# EasyEDA Pro project NUEVO board Rev. B.epro, board PCB1_1
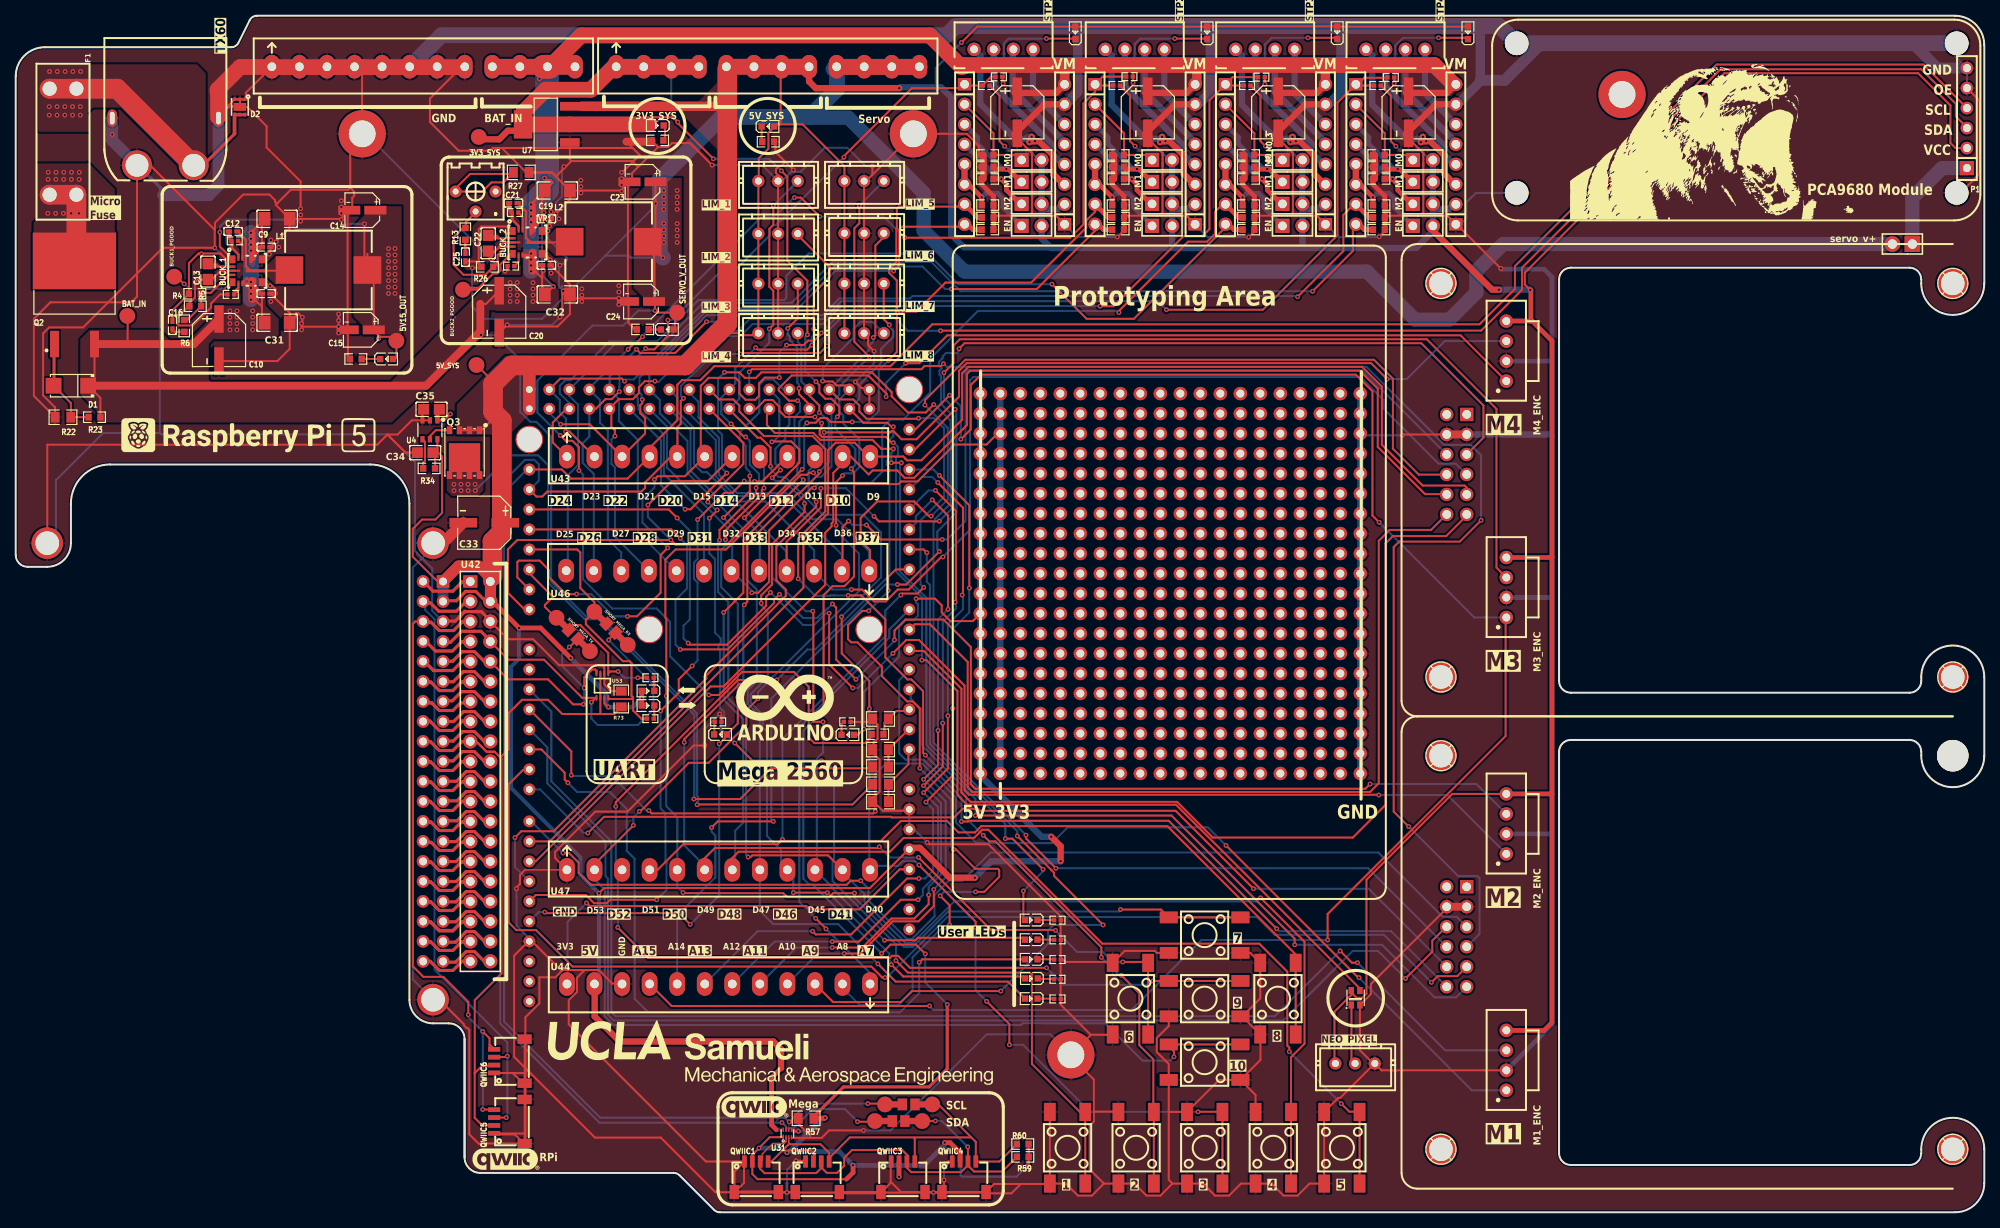
[diagram p12: board, top side]
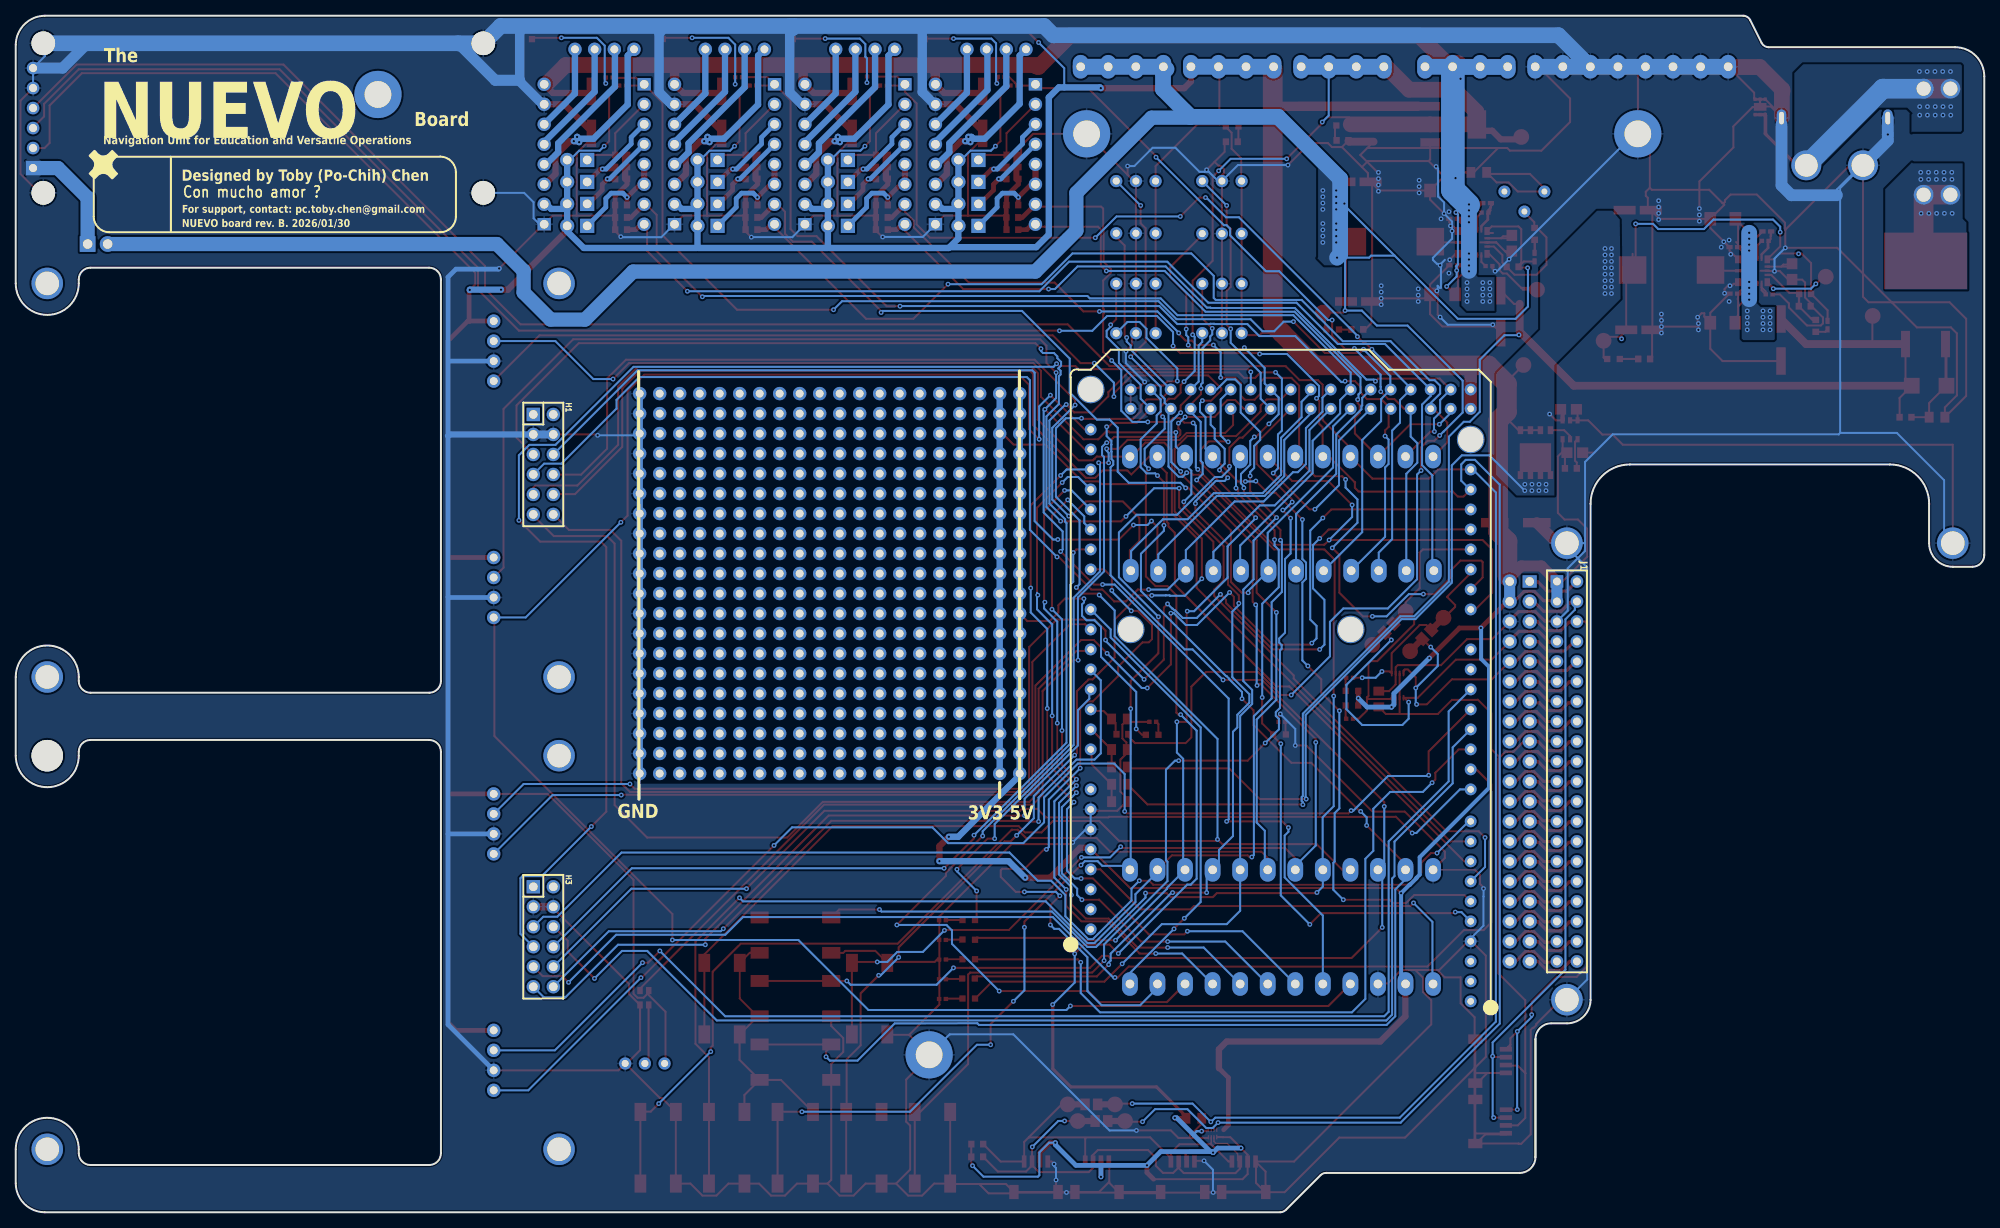
[diagram p13: board, bottom side, seen from below]

Outline 250 x 152 mm; copper layers: Top Layer, Bottom Layer. Coordinates in mm from the lower left corner of the outline.
Outline path: 57,22 arc(56.41,23.41) 55,24 53,24 arc(50.88,24.88) 50,27 50,90 arc(48.54,93.54) 45,95 12,95 arc(8.46,93.54) 7,90 7,85 arc(6.12,82.88) 4,82 1.5,82 arc(0.44,82.44) 0,83.5 0,144.3 arc(1.08,146.92) 3.7,148 27.38,148 arc(27.91,148.15) 28.28,148.55 29.72,151.45 arc(30.09,151.85) 30.62,152 246.3,152 arc(248.9,150.9) 250,148.3 250,118 arc(246,114) 242,118 242,118.5 arc(241.56,119.56) 240.5,120 197.5,120 arc(196.44,119.56) 196,118.5 196,67.5 arc(196.44,66.44) 197.5,66 240.5,66 arc(241.56,66.44) 242,67.5 242,68 arc(246,72) 250,68 250,58 arc(246,54) 242,58 242,58.5 arc(241.56,59.56) 240.5,60 197.5,60 arc(196.44,59.56) 196,58.5 196,7.5 arc(196.44,6.44) 197.5,6 240.5,6 arc(241.56,6.44) 242,7.5 242,8 arc(246,12) 250,8 250,3.7 arc(248.92,1.08) 246.3,0 89.41,0 arc(89.03,0.08) 88.71,0.29 84.29,4.71 arc(83.97,4.92) 83.59,5 59,5 arc(57.59,5.59) 57,7 ; 57,22 57,7 ; 57,22 57,7
Stack: Top Layer 0.035mm / Dielectric1 1.51mm FR4 er 4.5 / Bottom Layer 0.035mm

## Design rules (mm)
template: Custom Config
spacing copperThickness1oz (default): track to track 0.102, other pairs 0.14 to 0.3
spacing copperThickness2oz: track to track 0.203, other pairs 0.152 to 0.3
track width copperThickness1oz (default): min 0.127, default 0.254, max 4
track width copperThickness2oz: min 0.203, default 0.254, max 2.54
differential pair differentialPair (default): width min 0.127, default 0.254, max 2.54; gap min 0.152, default 0.152
via viaSize (default): diameter min 0.5, default 0.61, max 10; hole min 0.3, default 0.305, max 6.3

## Placement (name value [footprint] x y rotation side)
3V3_SYS  -  [2mm_exposure]  58.8 136.6 0 top
5V15_OUT  -  [2mm_exposure]  48.34 110.71 0 top
5V_SYS  -  [2mm_exposure]  58.52 107.63 0 top
10  KH-6X6X5H-STM  [SW-SMD_4P-L6.0-W6.0-P4.50-LS9.0_H5.0]  150.99 19.06 0 top
 1   -  [SW-SMD_4P-L6.0-W6.0-P4.50-LS9.0_H5.0]  133.58 8.19 270 top
 2   -  [SW-SMD_4P-L6.0-W6.0-P4.50-LS9.0_H5.0]  142.29 8.19 270 top
 3   -  [SW-SMD_4P-L6.0-W6.0-P4.50-LS9.0_H5.0]  151 8.19 270 top
 4   -  [SW-SMD_4P-L6.0-W6.0-P4.50-LS9.0_H5.0]  159.71 8.19 270 top
 5   -  [SW-SMD_4P-L6.0-W6.0-P4.50-LS9.0_H5.0]  168.42 8.19 270 top
 6   -  [SW-SMD_4P-L6.0-W6.0-P4.50-LS9.0_H5.0]  141.56 27.14 270 top
 7   -  [SW-SMD_4P-L6.0-W6.0-P4.50-LS9.0_H5.0]  150.99 35.21 0 top
 8   -  [SW-SMD_4P-L6.0-W6.0-P4.50-LS9.0_H5.0]  160.3 27.14 270 top
 9   -  [SW-SMD_4P-L6.0-W6.0-P4.50-LS9.0_H5.0]  150.99 27.14 0 top
BAT_IN  -  [2mm_exposure]  14.17 113.87 0 top
BUCK1_PGOOD  -  [2mm_exposure]  20.13 118.85 0 top
BUCK2_PGOOD  -  [2mm_exposure]  56.8 117.2 0 top
BUCK_1  LM61460AASQRJRRQ1  [VQFN-14-HR_L4.0-W3.5-TL_LM61460AASQRJRRQ1]  29.41 119.6 0 top
BUCK_2  LM61460AASQRJRRQ1  [VQFN-14-HR_L4.0-W3.5-TL_LM61460AASQRJRRQ1]  64.99 123.2 0 top
C1  47uF  [CAP-SMD_BD6.3-L6.6-W6.6-FD]  127.2 139.73 270 top
C2  47uF  [CAP-SMD_BD6.3-L6.6-W6.6-FD]  143.78 139.73 270 top
C7  100nF  [C0402]  31.8 116.7 0 top
C8  100nF  [C0402]  31.8 122.6 0 top
C9  10uF  [C1206]  33.2 126.2 0 top
C10  100uF  [CAP-SMD_BD6.3-L6.6-W6.6-LS7.2-FD]  25.81 110.8 270 top
C12  100nF  [C0402]  27.61 124.6 0 top
C13  1uF  [C0805]  24.41 119.5 90 top
C14  47uF  [CAP-SMD_BD4.0-L4.3-W4.3-FD-LS5.5]  44.01 127.3 180 top
C15  47uF  [CAP-SMD_BD4.0-L4.3-W4.3-FD-LS5.5]  43.81 112.1 180 top
C16  22pF  [C0402]  19.9 112.7 270 top
C17  100nF  [C0402]  67.39 126.2 0 top
C18  100nF  [C0402]  67.39 120.3 0 top
C19  10uF  [C1206]  68.79 129.8 0 top
C20  100uF  [CAP-SMD_BD6.3-L6.6-W6.6-LS7.2-FD]  61.4 114.4 270 top
C21  100nF  [C0402]  63.2 128.2 0 top
C22  1uF  [C0805]  60 123.1 90 top
C23  47uF  [CAP-SMD_BD4.0-L4.3-W4.3-FD-LS5.5]  79.6 130.9 180 top
C24  47uF  [CAP-SMD_BD4.0-L4.3-W4.3-FD-LS5.5]  79.4 115.7 180 top
C25  22pF  [C0402]  57.11 121.34 90 top
C26  47uF  [CAP-SMD_BD6.3-L6.6-W6.6-FD]  160.33 139.73 270 top
C27  47uF  [CAP-SMD_BD6.3-L6.6-W6.6-FD]  176.89 139.73 270 top
C31  10uF  [C1206]  33.2 113 0 top
C32  10uF  [C1206]  68.79 116.6 0 top
C33  100uF  [CAP-SMD_BD6.3-L6.6-W6.6-LS7.2-FD]  59.5 87.6 180 top
C34  1uF  [C0805]  52 96.5 0 top
C35  1uF  [C0805]  52.8 102 0 top
D1  SMAZ15-13-F  [SMA_L4.3-W2.6-LS5.2-RD]  7 105 180 top
D2  TVS2700DRVR  [WSON-6_L2.0-W2.0-P0.65-BL-EP]  28.46 140.42 180 top
F1  3557-2  [FUSE-TH_4P-L19.8-W6.7_3557-2]  6 136 270 top
H1  2.54-2*6P母  [HDR-TH_12P-P2.54-V-F-R2-C6-S2.54]  183 95 270 bottom
H3  2.54-2*6P母  [HDR-TH_12P-P2.54-V-F-R2-C6-S2.54]  183 35 270 bottom
J1  RPi5_pinout_2.54-2*20  [HDR-TH_40P-P2.54-V-F-R2-C20-S2.54]  53 56 270 bottom
JP_EN_1  HX PZ2.54-1x2P ZZ  [HDR-TH_2P-P2.54-V-M-3]  129.01 125.31 0 top
JP_EN_2  HX PZ2.54-1x2P ZZ  [HDR-TH_2P-P2.54-V-M-3]  145.59 125.31 0 top
JP_EN_3  HX PZ2.54-1x2P ZZ  [HDR-TH_2P-P2.54-V-M-3]  162.14 125.31 0 top
JP_EN_4  HX PZ2.54-1x2P ZZ  [HDR-TH_2P-P2.54-V-M-3]  178.7 125.31 0 top
JP_M0_1  HX PZ2.54-1x2P ZZ  [HDR-TH_2P-P2.54-V-M-3]  129.01 133.68 0 top
JP_M0_2  HX PZ2.54-1x2P ZZ  [HDR-TH_2P-P2.54-V-M-3]  145.59 133.68 0 top
JP_M0_3  HX PZ2.54-1x2P ZZ  [HDR-TH_2P-P2.54-V-M-3]  162.14 133.68 0 top
JP_M0_4  HX PZ2.54-1x2P ZZ  [HDR-TH_2P-P2.54-V-M-3]  178.7 133.68 0 top
JP_M1_1  HX PZ2.54-1x2P ZZ  [HDR-TH_2P-P2.54-V-M-3]  129.01 130.89 0 top
JP_M1_2  HX PZ2.54-1x2P ZZ  [HDR-TH_2P-P2.54-V-M-3]  145.59 130.89 0 top
JP_M1_3  HX PZ2.54-1x2P ZZ  [HDR-TH_2P-P2.54-V-M-3]  162.14 130.89 0 top
JP_M1_4  HX PZ2.54-1x2P ZZ  [HDR-TH_2P-P2.54-V-M-3]  178.7 130.89 0 top
JP_M2_1  HX PZ2.54-1x2P ZZ  [HDR-TH_2P-P2.54-V-M-3]  129.01 128.1 0 top
JP_M2_2  HX PZ2.54-1x2P ZZ  [HDR-TH_2P-P2.54-V-M-3]  145.59 128.1 0 top
JP_M2_3  HX PZ2.54-1x2P ZZ  [HDR-TH_2P-P2.54-V-M-3]  162.14 128.1 0 top
JP_M2_4  HX PZ2.54-1x2P ZZ  [HDR-TH_2P-P2.54-V-M-3]  178.7 128.1 0 top
L1  4.7uH  [IND-SMD_L11.0-W10.0]  39.71 119.7 0 top
L2  4.7uH  [IND-SMD_L11.0-W10.0]  75.3 123.3 0 top
LED_BLUE  XL-1608UBC-04  [LED0603-RD_BLUE]  128.97 34.63 180 top
LED_BLUE1  XL-1608UBC-04  [LED0603-RD_BLUE]  134.57 149.82 90 top
LED_BLUE2  XL-1608UBC-04  [LED0603-RD_BLUE]  151.31 149.82 90 top
LED_BLUE4  XL-1608UBC-04  [LED0603-RD_BLUE]  184.44 149.83 90 top
LED_BLUE5  XL-1608UBC-04  [LED0603-RD_BLUE]  167.83 149.84 90 top
LED_BLUE6  XL-1608UBC-04  [LED0603-RD_BLUE]  47.09 108.39 0 top
LED_BLUE7  XL-1608UBC-04  [LED0603-RD_BLUE]  82.74 112.14 0 top
LED_GREEN  TZ-P2-0603YGTCS1-0.6T  [LED0603-RD]  128.97 37.13 180 top
LED_GREEN1  TZ-P2-0603YGTCS1-0.6T  [LED0603-RD]  80.3 64.38 180 top
LED_GREEN2  TZ-P2-0603YGTCS1-0.6T  [LED0603-RD]  105.68 60.66 0 top
LED_GREEN3  TZ-P2-0603YGTCS1-0.6T  [LED0603-RD]  81.49 138.06 180 top
LED_GREEN4  TZ-P2-0603YGTCS1-0.6T  [LED0603-RD]  95.52 137.93 0 top
LED_ORANGE  LTST-C190KFKT  [LED0603-RD]  129 29.7 180 top
LED_ORANGE1  LTST-C190KFKT  [LED0603-RD]  80.3 66.23 180 top
LED_ORANGE2  LTST-C190KFKT  [LED0603-RD]  89.5 60.7 0 top
LED_PURPLE  XL-1608UVC-04  [LED0603-RD_PINK]  128.97 27.14 180 top
LED_RED  XL-1608SURC-06  [LED0603-RD_RED]  128.97 32.14 180 top
LIM_1  B3B-XH-A(LF)(SN)  [CONN-TH_3P-P2.50_A2501WV2-3P]  96.82 131 0 top
LIM_2  B3B-XH-A(LF)(SN)  [CONN-TH_3P-P2.50_A2501WV2-3P]  96.82 124.32 0 top
LIM_3  B3B-XH-A(LF)(SN)  [CONN-TH_3P-P2.50_A2501WV2-3P]  96.82 117.96 0 top
LIM_4  B3B-XH-A(LF)(SN)  [CONN-TH_3P-P2.50_A2501WV2-3P]  96.82 111.67 0 top
LIM_5  B3B-XH-A(LF)(SN)  [CONN-TH_3P-P2.50_A2501WV2-3P]  107.74 131 0 top
LIM_6  B3B-XH-A(LF)(SN)  [CONN-TH_3P-P2.50_A2501WV2-3P]  107.74 124.37 0 top
LIM_7  B3B-XH-A(LF)(SN)  [CONN-TH_3P-P2.50_A2501WV2-3P]  107.74 117.97 0 top
LIM_8  B3B-XH-A(LF)(SN)  [CONN-TH_3P-P2.50_A2501WV2-3P]  107.74 111.67 0 top
M1_ENC  705430003  [CONN-TH_705430003]  189.3 19.3 270 top
M2_ENC  705430003  [CONN-TH_705430003]  189.3 49.33 270 top
M3_ENC  705430003  [CONN-TH_705430003]  189.3 79.37 270 top
M4_ENC  705430003  [CONN-TH_705430003]  189.3 109.4 270 top
NEO_PIXEL  B3B-XH-A(LF)(SN)  [CONN-TH_3P-P2.50_A2501WV2-3P]  170.1 18.9 0 top
NOREF  -  [Pad_e8906]  170.76 93.84 0 top
NOREF#2  -  [Pad_e9094]  140.28 68.44 0 top
NOREF#3  -  [Pad_e8835]  142.82 101.46 0 top
NOREF#4  -  [Pad_e8940]  155.52 88.76 0 top
NOREF#5  -  [Pad_e8871]  132.66 96.38 0 top
NOREF#6  -  [Pad_e8915]  142.82 91.3 0 top
NOREF#7  -  [Pad_e9155]  142.82 60.82 0 top
NOREF#8  -  [Pad_e9147]  122.5 60.82 0 top
NOREF#9  -  [Pad_e8836]  145.36 101.46 0 top
NOREF#10  -  [Pad_e8810]  130.12 104 0 top
NOREF#11  -  [Pad_e483]  190.62 148.5 0 top
NOREF#12  -  [Pad_e9200]  155.52 55.74 0 top
NOREF#13  -  [Pad_e8991]  132.66 81.14 0 top
NOREF#14  -  [Pad_e8884]  165.68 96.38 0 top
NOREF#15  -  [Pad_e9064]  165.68 73.52 0 top
NOREF#16  -  [Pad_e8912]  135.2 91.3 0 top
NOREF#17  -  [Pad_e8992]  135.2 81.14 0 top
NOREF#18  -  [Pad_e8828]  125.04 101.46 0 top
NOREF#19  -  [Pad_e9166]  170.76 60.82 0 top
NOREF#20  -  [Pad_e9038]  150.44 76.06 0 top
NOREF#21  -  [Pad_e9020]  155.52 78.6 0 top
NOREF#22  -  [Pad_e9017]  147.9 78.6 0 top
NOREF#23  -  [Pad_e9149]  127.58 60.82 0 top
NOREF#24  -  [Pad_e9054]  140.28 73.52 0 top
NOREF#25  -  [Pad_e9001]  158.06 81.14 0 top
NOREF#26  -  [Pad_e9125]  168.22 65.9 0 top
NOREF#27  -  [Pad_e9024]  165.68 78.6 0 top
NOREF#28  -  [Pad_e8821]  158.06 104 0 top
NOREF#29  -  [Pad_e8925]  168.22 91.3 0 top
NOREF#30  -  [Pad_e9139]  152.98 63.36 0 top
NOREF#31  -  [Pad_e9154]  140.28 60.82 0 top
NOREF#32  -  [Pad_e8937]  147.9 88.76 0 top
NOREF#33  -  [Pad_e9176]  145.36 58.28 0 top
NOREF#34  -  [Pad_e8893]  137.74 93.84 0 top
NOREF#35  -  [Pad_e8895]  142.82 93.84 0 top
NOREF#36  -  [Pad_e8849]  127.58 98.92 0 top
NOREF#37  -  [Pad_e9007]  122.5 78.6 0 top
NOREF#38  -  [Pad_e8999]  152.98 81.14 0 top
NOREF#39  -  [Pad_e9183]  163.14 58.28 0 top
NOREF#40  -  [Pad_e8910]  130.12 91.3 0 top
NOREF#41  -  [Pad_e9173]  137.74 58.28 0 top
NOREF#42  -  [Pad_e9143]  163.14 63.36 0 top
NOREF#43  -  [Pad_e8833]  137.74 101.46 0 top
NOREF#44  -  [Pad_e8956]  145.36 86.22 0 top
NOREF#45  -  [Pad_e9000]  155.52 81.14 0 top
NOREF#46  -  [Pad_e9056]  145.36 73.52 0 top
NOREF#47  -  [Pad_e8904]  165.68 93.84 0 top
NOREF#48  -  [Pad_e9091]  132.66 68.44 0 top
NOREF#49  -  [Pad_e8825]  168.22 104 0 top
NOREF#50  -  [Pad_e8934]  140.28 88.76 0 top
NOREF#51  -  [Pad_e9041]  158.06 76.06 0 top
NOREF#52  -  [Pad_e9169]  127.58 58.28 0 top
NOREF#53  -  [Pad_e9186]  170.76 58.28 0 top
NOREF#54  -  [Pad_e9032]  135.2 76.06 0 top
NOREF#55  -  [Pad_e8984]  165.68 83.68 0 top
NOREF#56  -  [Pad_e9242]  44 137 0 top
NOREF#57  -  [Pad_e8907]  122.5 91.3 0 top
NOREF#58  -  [Pad_e9170]  130.12 58.28 0 top
NOREF#59  -  [Pad_e9068]  125.04 70.98 0 top
NOREF#60  -  [Pad_e9120]  155.52 65.9 0 top
NOREF#61  -  [Pad_e9193]  137.74 55.74 0 top
NOREF#62  -  [Pad_e9057]  147.9 73.52 0 top
NOREF#63  -  [Pad_e8972]  135.2 83.68 0 top
NOREF#64  -  [Pad_e9092]  135.2 68.44 0 top
NOREF#65  -  [Pad_e8817]  147.9 104 0 top
NOREF#66  -  [Pad_e9005]  168.22 81.14 0 top
NOREF#67  -  [Pad_e8954]  140.28 86.22 0 top
NOREF#68  -  [Pad_e9098]  150.44 68.44 0 top
NOREF#69  -  [Pad_e9150]  130.12 60.82 0 top
NOREF#70  -  [Pad_e9072]  135.2 70.98 0 top
NOREF#71  -  [Pad_e9018]  150.44 78.6 0 top
NOREF#72  -  [Pad_e9053]  137.74 73.52 0 top
NOREF#73  -  [Pad_e8880]  155.52 96.38 0 top
NOREF#74  -  [Pad_e8891]  132.66 93.84 0 top
NOREF#75  -  [Pad_e9047]  122.5 73.52 0 top
NOREF#76  -  [Pad_e8926]  170.76 91.3 0 top
NOREF#77  -  [Pad_e9075]  142.82 70.98 0 top
NOREF#78  -  [Pad_e9127]  122.5 63.36 0 top
NOREF#79  -  [Pad_e8808]  125.04 104 0 top
NOREF#80  -  [Pad_e8993]  137.74 81.14 0 top
NOREF#81  -  [Pad_e8831]  132.66 101.46 0 top
NOREF#82  -  [Pad_e8867]  122.5 96.38 0 top
NOREF#83  -  [Pad_e9085]  168.22 70.98 0 top
NOREF#84  -  [Pad_e9012]  135.2 78.6 0 top
NOREF#85  -  [Pad_e9142]  160.6 63.36 0 top
NOREF#86  -  [Pad_e9134]  140.28 63.36 0 top
NOREF#87  -  [Pad_e9079]  152.98 70.98 0 top
NOREF#88  -  [Pad_e8971]  132.66 83.68 0 top
NOREF#89  -  [Pad_e8985]  168.22 83.68 0 top
NOREF#90  -  [Pad_e9196]  145.36 55.74 0 top
NOREF#91  -  [Pad_e9009]  127.58 78.6 0 top
NOREF#92  -  [Pad_e8882]  160.6 96.38 0 top
NOREF#93  -  [Pad_e8841]  158.06 101.46 0 top
NOREF#94  -  [Pad_e8854]  140.28 98.92 0 top
NOREF#95  -  [Pad_e8824]  165.68 104 0 top
NOREF#96  -  [Pad_e8899]  152.98 93.84 0 top
NOREF#97  -  [Pad_e9199]  152.98 55.74 0 top
NOREF#98  -  [Pad_e9122]  160.6 65.9 0 top
NOREF#99  -  [Pad_e8931]  132.66 88.76 0 top
NOREF#100  -  [Pad_e9086]  170.76 70.98 0 top
NOREF#101  -  [Pad_e9105]  168.22 68.44 0 top
NOREF#102  -  [Pad_e9028]  125.04 76.06 0 top
NOREF#103  -  [Pad_e9070]  130.12 70.98 0 top
NOREF#104  -  [Pad_e9129]  127.58 63.36 0 top
NOREF#105  -  [Pad_e7453]  4 85 0 top
NOREF#106  -  [Pad_e8845]  168.22 101.46 0 top
NOREF#107  -  [Pad_e8987]  122.5 81.14 0 top
NOREF#108  -  [Pad_e9156]  145.36 60.82 0 top
NOREF#109  -  [Pad_e159]  122.5 104 0 top
NOREF#110  -  [Pad_e9112]  135.2 65.9 0 top
NOREF#111  -  [Pad_e9140]  155.52 63.36 0 top
NOREF#112  -  [Pad_e6985]  53 27 0 top
NOREF#113  -  [Pad_e8919]  152.98 91.3 0 top
NOREF#114  -  [Pad_e9245]  134 20 0 top
NOREF#115  -  [Pad_e8876]  145.36 96.38 0 top
NOREF#116  -  [Pad_e9246]  114 137 0 top
NOREF#117  -  [Pad_e8878]  150.44 96.38 0 top
NOREF#118  -  [Pad_e9197]  147.9 55.74 0 top
NOREF#119  -  [Pad_e8829]  127.58 101.46 0 top
NOREF#120  -  [Pad_e8903]  163.14 93.84 0 top
NOREF#121  -  [Pad_e9048]  125.04 73.52 0 top
NOREF#122  -  [Pad_e9071]  132.66 70.98 0 top
NOREF#123  -  [Pad_e9069]  127.58 70.98 0 top
NOREF#124  -  [Pad_e9164]  165.68 60.82 0 top
NOREF#125  -  [Pad_e8933]  137.74 88.76 0 top
NOREF#126  -  [Pad_e8973]  137.74 83.68 0 top
NOREF#127  -  [Pad_e9011]  132.66 78.6 0 top
NOREF#128  -  [Pad_e9003]  163.14 81.14 0 top
NOREF#129  -  [Pad_e9021]  158.06 78.6 0 top
NOREF#130  -  [Pad_e8868]  125.04 96.38 0 top
NOREF#131  -  [Pad_e8812]  135.2 104 0 top
NOREF#132  -  [Pad_e8816]  145.36 104 0 top
NOREF#133  -  [Pad_e9107]  122.5 65.9 0 top
NOREF#134  -  [Pad_e8875]  142.82 96.38 0 top
NOREF#135  -  [Pad_e8848]  125.04 98.92 0 top
NOREF#136  -  [Pad_e8932]  135.2 88.76 0 top
NOREF#137  -  [Pad_e9102]  160.6 68.44 0 top
NOREF#138  -  [Pad_e9042]  160.6 76.06 0 top
NOREF#139  -  [Pad_e8974]  140.28 83.68 0 top
NOREF#140  -  [Pad_e9023]  163.14 78.6 0 top
NOREF#141  -  [Pad_e9060]  155.52 73.52 0 top
NOREF#142  -  [Pad_e9044]  165.68 76.06 0 top
NOREF#143  -  [Pad_e8998]  150.44 81.14 0 top
NOREF#144  -  [Pad_e9103]  163.14 68.44 0 top
NOREF#145  -  [Pad_e9162]  160.6 60.82 0 top
NOREF#146  -  [Pad_e8918]  150.44 91.3 0 top
NOREF#147  -  [Pad_e8908]  125.04 91.3 0 top
NOREF#148  -  [Pad_e8815]  142.82 104 0 top
NOREF#149  -  [Pad_e8897]  147.9 93.84 0 top
NOREF#150  -  [Pad_e8827]  122.5 101.46 0 top
NOREF#151  -  [Pad_e8914]  140.28 91.3 0 top
NOREF#152  -  [Pad_e9172]  135.2 58.28 0 top
NOREF#153  -  [Pad_e8924]  165.68 91.3 0 top
NOREF#154  -  [Pad_e9179]  152.98 58.28 0 top
NOREF#155  -  [Pad_e8853]  137.74 98.92 0 top
NOREF#156  -  [Pad_e9015]  142.82 78.6 0 top
NOREF#157  -  [Pad_e9037]  147.9 76.06 0 top
NOREF#158  -  [Pad_e8930]  130.12 88.76 0 top
NOREF#159  -  [Pad_e8944]  165.68 88.76 0 top
NOREF#160  -  [Pad_e8981]  158.06 83.68 0 top
NOREF#161  -  [Pad_e8982]  160.6 83.68 0 top
NOREF#162  -  [Pad_e8864]  165.68 98.92 0 top
NOREF#163  -  [Pad_e8894]  140.28 93.84 0 top
NOREF#164  -  [Pad_e9114]  140.28 65.9 0 top
NOREF#165  -  [Pad_e8997]  147.9 81.14 0 top
NOREF#166  -  [Pad_e8862]  160.6 98.92 0 top
NOREF#167  -  [Pad_e8858]  150.44 98.92 0 top
NOREF#168  -  [Pad_e9189]  127.58 55.74 0 top
NOREF#169  -  [Pad_e8994]  140.28 81.14 0 top
NOREF#170  -  [Pad_e9175]  142.82 58.28 0 top
NOREF#171  -  [Pad_e9133]  137.74 63.36 0 top
NOREF#172  -  [Pad_e9174]  140.28 58.28 0 top
NOREF#173  -  [Pad_e9055]  142.82 73.52 0 top
NOREF#174  -  [Pad_e9115]  142.82 65.9 0 top
NOREF#175  -  [Pad_e9031]  132.66 76.06 0 top
NOREF#176  -  [Pad_e9152]  135.2 60.82 0 top
NOREF#177  -  [Pad_e9178]  150.44 58.28 0 top
NOREF#178  -  [Pad_e9163]  163.14 60.82 0 top
NOREF#179  -  [Pad_e9006]  170.76 81.14 0 top
NOREF#180  -  [Pad_e8950]  130.12 86.22 0 top
NOREF#181  -  [Pad_e8896]  145.36 93.84 0 top
NOREF#182  -  [Pad_e9096]  145.36 68.44 0 top
NOREF#183  -  [Pad_e8879]  152.98 96.38 0 top
NOREF#184  -  [Pad_e9198]  150.44 55.74 0 top
NOREF#185  -  [Pad_e8962]  160.6 86.22 0 top
NOREF#186  -  [Pad_e9045]  168.22 76.06 0 top
NOREF#187  -  [Pad_e9148]  125.04 60.82 0 top
NOREF#188  -  [Pad_e8855]  142.82 98.92 0 top
NOREF#189  -  [Pad_e9036]  145.36 76.06 0 top
NOREF#190  -  [Pad_e8863]  163.14 98.92 0 top
NOREF#191  -  [Pad_e7452]  53 85 0 top
NOREF#192  -  [Pad_e8945]  168.22 88.76 0 top
NOREF#193  -  [Pad_e9145]  168.22 63.36 0 top
NOREF#194  -  [Pad_e9111]  132.66 65.9 0 top
NOREF#195  -  [Pad_e9167]  122.5 58.28 0 top
NOREF#196  -  [Pad_e9130]  130.12 63.36 0 top
NOREF#197  -  [Pad_e9108]  125.04 65.9 0 top
NOREF#198  -  [Pad_e8887]  122.5 93.84 0 top
NOREF#199  -  [Pad_e8889]  127.58 93.84 0 top
NOREF#200  -  [Pad_e8913]  137.74 91.3 0 top
NOREF#201  -  [Pad_e8842]  160.6 101.46 0 top
NOREF#202  -  [Pad_e8820]  155.52 104 0 top
NOREF#203  -  [Pad_e9117]  147.9 65.9 0 top
NOREF#204  -  [Pad_e9035]  142.82 76.06 0 top
NOREF#205  -  [Pad_e9195]  142.82 55.74 0 top
NOREF#206  -  [Pad_e8996]  145.36 81.14 0 top
NOREF#207  -  [Pad_e8980]  155.52 83.68 0 top
NOREF#208  -  [Pad_e8874]  140.28 96.38 0 top
NOREF#209  -  [Pad_e9022]  160.6 78.6 0 top
NOREF#210  -  [Pad_e9049]  127.58 73.52 0 top
NOREF#211  -  [Pad_e8811]  132.66 104 0 top
NOREF#212  -  [Pad_e9191]  132.66 55.74 0 top
NOREF#213  -  [Pad_e9013]  137.74 78.6 0 top
NOREF#214  -  [Pad_e8813]  137.74 104 0 top
NOREF#215  -  [Pad_e8852]  135.2 98.92 0 top
NOREF#216  -  [Pad_e9181]  158.06 58.28 0 top
NOREF#217  -  [Pad_e9206]  170.76 55.74 0 top
NOREF#218  -  [Pad_e9157]  147.9 60.82 0 top
NOREF#219  -  [Pad_e9029]  127.58 76.06 0 top
NOREF#220  -  [Pad_e9180]  155.52 58.28 0 top
NOREF#221  -  [Pad_e8979]  152.98 83.68 0 top
NOREF#222  -  [Pad_e9100]  155.52 68.44 0 top
NOREF#223  -  [Pad_e9084]  165.68 70.98 0 top
NOREF#224  -  [Pad_e9097]  147.9 68.44 0 top
NOREF#225  -  [Pad_e486]  246.5 148.5 0 top
NOREF#226  -  [Pad_e9073]  137.74 70.98 0 top
NOREF#227  -  [Pad_e8832]  135.2 101.46 0 top
NOREF#228  -  [Pad_e9137]  147.9 63.36 0 top
NOREF#229  -  [Pad_e8986]  170.76 83.68 0 top
NOREF#230  -  [Pad_e8869]  127.58 96.38 0 top
NOREF#231  -  [Pad_e8840]  155.52 101.46 0 top
NOREF#232  -  [Pad_e8861]  158.06 98.92 0 top
NOREF#233  -  [Pad_e8955]  142.82 86.22 0 top
NOREF#234  -  [Pad_e8826]  170.76 104 0 top
NOREF#235  -  [Pad_e9202]  160.6 55.74 0 top
NOREF#236  -  [Pad_e8890]  130.12 93.84 0 top
NOREF#237  -  [Pad_e9124]  165.68 65.9 0 top
NOREF#238  -  [Pad_e9083]  163.14 70.98 0 top
NOREF#239  -  [Pad_e9205]  168.22 55.74 0 top
NOREF#240  -  [Pad_e9088]  125.04 68.44 0 top
NOREF#241  -  [Pad_e9099]  152.98 68.44 0 top
NOREF#242  -  [Pad_e9059]  152.98 73.52 0 top
NOREF#243  -  [Pad_e8928]  125.04 88.76 0 top
NOREF#244  -  [Pad_e8920]  155.52 91.3 0 top
NOREF#245  -  [Pad_e8885]  168.22 96.38 0 top
NOREF#246  -  [Pad_e8902]  160.6 93.84 0 top
NOREF#247  -  [Pad_e8819]  152.98 104 0 top
NOREF#248  -  [Pad_e8959]  152.98 86.22 0 top
NOREF#249  -  [Pad_e9058]  150.44 73.52 0 top
NOREF#250  -  [Pad_e9116]  145.36 65.9 0 top
NOREF#251  -  [Pad_e8936]  145.36 88.76 0 top
NOREF#252  -  [Pad_e8866]  170.76 98.92 0 top
NOREF#253  -  [Pad_e9089]  127.58 68.44 0 top
NOREF#254  -  [Pad_e9008]  125.04 78.6 0 top
NOREF#255  -  [Pad_e9203]  163.14 55.74 0 top
NOREF#256  -  [Pad_e8901]  158.06 93.84 0 top
NOREF#257  -  [Pad_e9050]  130.12 73.52 0 top
NOREF#258  -  [Pad_e9033]  137.74 76.06 0 top
NOREF#259  -  [Pad_e8921]  158.06 91.3 0 top
NOREF#260  -  [Pad_e8995]  142.82 81.14 0 top
NOREF#261  -  [Pad_e8909]  127.58 91.3 0 top
NOREF#262  -  [Pad_e8905]  168.22 93.84 0 top
NOREF#263  -  [Pad_e9027]  122.5 76.06 0 top
NOREF#264  -  [Pad_e8970]  130.12 83.68 0 top
NOREF#265  -  [Pad_e9076]  145.36 70.98 0 top
NOREF#266  -  [Pad_e8951]  132.66 86.22 0 top
NOREF#267  -  [Pad_e9106]  170.76 68.44 0 top
NOREF#268  -  [Pad_e8990]  130.12 81.14 0 top
NOREF#269  -  [Pad_e8809]  127.58 104 0 top
NOREF#270  -  [Pad_e9062]  160.6 73.52 0 top
NOREF#271  -  [Pad_e9025]  168.22 78.6 0 top
NOREF#272  -  [Pad_e8949]  127.58 86.22 0 top
NOREF#273  -  [Pad_e9192]  135.2 55.74 0 top
NOREF#274  -  [Pad_e9128]  125.04 63.36 0 top
NOREF#275  -  [Pad_e8886]  170.76 96.38 0 top
NOREF#276  -  [Pad_e8946]  170.76 88.76 0 top
NOREF#277  -  [Pad_e9110]  130.12 65.9 0 top
NOREF#278  -  [Pad_e8900]  155.52 93.84 0 top
NOREF#279  -  [Pad_e9004]  165.68 81.14 0 top
NOREF#280  -  [Pad_e9077]  147.9 70.98 0 top
NOREF#281  -  [Pad_e9066]  170.76 73.52 0 top
NOREF#282  -  [Pad_e9165]  168.22 60.82 0 top
NOREF#283  -  [Pad_e9087]  122.5 68.44 0 top
NOREF#284  -  [Pad_e9010]  130.12 78.6 0 top
NOREF#285  -  [Pad_e9014]  140.28 78.6 0 top
NOREF#286  -  [Pad_e8966]  170.76 86.22 0 top
NOREF#287  -  [Pad_e8968]  125.04 83.68 0 top
NOREF#288  -  [Pad_e8952]  135.2 86.22 0 top
NOREF#289  -  [Pad_e9026]  170.76 78.6 0 top
NOREF#290  -  [Pad_e9244]  204 142 0 top
NOREF#291  -  [Pad_e8929]  127.58 88.76 0 top
NOREF#292  -  [Pad_e9063]  163.14 73.52 0 top
NOREF#293  -  [Pad_e9080]  155.52 70.98 0 top
NOREF#294  -  [Pad_e9039]  152.98 76.06 0 top
NOREF#295  -  [Pad_e9109]  127.58 65.9 0 top
NOREF#296  -  [Pad_e8911]  132.66 91.3 0 top
NOREF#297  -  [Pad_e9188]  125.04 55.74 0 top
NOREF#298  -  [Pad_e9136]  145.36 63.36 0 top
NOREF#299  -  [Pad_e8847]  122.5 98.92 0 top
NOREF#300  -  [Pad_e8838]  150.44 101.46 0 top
NOREF#301  -  [Pad_e9204]  165.68 55.74 0 top
NOREF#302  -  [Pad_e9146]  170.76 63.36 0 top
NOREF#303  -  [Pad_e8947]  122.5 86.22 0 top
NOREF#304  -  [Pad_e8870]  130.12 96.38 0 top
NOREF#305  -  [Pad_e9131]  132.66 63.36 0 top
NOREF#306  -  [Pad_e8963]  163.14 86.22 0 top
NOREF#307  -  [Pad_e9160]  155.52 60.82 0 top
NOREF#308  -  [Pad_e9093]  137.74 68.44 0 top
NOREF#309  -  [Pad_e9187]  122.5 55.74 0 top
NOREF#310  -  [Pad_e8941]  158.06 88.76 0 top
NOREF#311  -  [Pad_e8978]  150.44 83.68 0 top
NOREF#312  -  [Pad_e9177]  147.9 58.28 0 top
NOREF#313  -  [Pad_e9159]  152.98 60.82 0 top
NOREF#314  -  [Pad_e9074]  140.28 70.98 0 top
NOREF#315  -  [Pad_e8957]  147.9 86.22 0 top
NOREF#316  -  [Pad_e8922]  160.6 91.3 0 top
NOREF#317  -  [Pad_e8865]  168.22 98.92 0 top
NOREF#318  -  [Pad_e8888]  125.04 93.84 0 top
NOREF#319  -  [Pad_e8943]  163.14 88.76 0 top
NOREF#320  -  [Pad_e8967]  122.5 83.68 0 top
NOREF#321  -  [Pad_e8892]  135.2 93.84 0 top
NOREF#322  -  [Pad_e8846]  170.76 101.46 0 top
NOREF#323  -  [Pad_e8958]  150.44 86.22 0 top
NOREF#324  -  [Pad_e9135]  142.82 63.36 0 top
NOREF#325  -  [Pad_e9113]  137.74 65.9 0 top
NOREF#326  -  [Pad_e8960]  155.52 86.22 0 top
NOREF#327  -  [Pad_e9090]  130.12 68.44 0 top
NOREF#328  -  [Pad_e9052]  135.2 73.52 0 top
NOREF#329  -  [Pad_e9030]  130.12 76.06 0 top
NOREF#330  -  [Pad_e9158]  150.44 60.82 0 top
NOREF#331  -  [Pad_e9151]  132.66 60.82 0 top
NOREF#332  -  [Pad_e9171]  132.66 58.28 0 top
NOREF#333  -  [Pad_e8834]  140.28 101.46 0 top
NOREF#334  -  [Pad_e9016]  145.36 78.6 0 top
NOREF#335  -  [Pad_e9104]  165.68 68.44 0 top
NOREF#336  -  [Pad_e487]  190.62 129.5 0 top
NOREF#337  -  [Pad_e8843]  163.14 101.46 0 top
NOREF#338  -  [Pad_e9161]  158.06 60.82 0 top
NOREF#339  -  [Pad_e9168]  125.04 58.28 0 top
NOREF#340  -  [Pad_e9121]  158.06 65.9 0 top
NOREF#341  -  [Pad_e8961]  158.06 86.22 0 top
NOREF#342  -  [Pad_e9132]  135.2 63.36 0 top
NOREF#343  -  [Pad_e9141]  158.06 63.36 0 top
NOREF#344  -  [Pad_e9101]  158.06 68.44 0 top
NOREF#345  -  [Pad_e9190]  130.12 55.74 0 top
NOREF#346  -  [Pad_e8935]  142.82 88.76 0 top
NOREF#347  -  [Pad_e8948]  125.04 86.22 0 top
NOREF#348  -  [Pad_e8927]  122.5 88.76 0 top
NOREF#349  -  [Pad_e9144]  165.68 63.36 0 top
NOREF#350  -  [Pad_e9118]  150.44 65.9 0 top
NOREF#351  -  [Pad_e8923]  163.14 91.3 0 top
NOREF#352  -  [Pad_e9182]  160.6 58.28 0 top
NOREF#353  -  [Pad_e8883]  163.14 96.38 0 top
NOREF#354  -  [Pad_e8877]  147.9 96.38 0 top
NOREF#355  -  [Pad_e8856]  145.36 98.92 0 top
NOREF#356  -  [Pad_e9185]  168.22 58.28 0 top
NOREF#357  -  [Pad_e9095]  142.82 68.44 0 top
NOREF#358  -  [Pad_e8989]  127.58 81.14 0 top
NOREF#359  -  [Pad_e8814]  140.28 104 0 top
NOREF#360  -  [Pad_e8830]  130.12 101.46 0 top
NOREF#361  -  [Pad_e485]  246.5 129.5 0 top
NOREF#362  -  [Pad_e9067]  122.5 70.98 0 top
NOREF#363  -  [Pad_e9123]  163.14 65.9 0 top
NOREF#364  -  [Pad_e8942]  160.6 88.76 0 top
NOREF#365  -  [Pad_e8983]  163.14 83.68 0 top
NOREF#366  -  [Pad_e9201]  158.06 55.74 0 top
NOREF#367  -  [Pad_e9061]  158.06 73.52 0 top
NOREF#368  -  [Pad_e8837]  147.9 101.46 0 top
NOREF#369  -  [Pad_e8823]  163.14 104 0 top
NOREF#370  -  [Pad_e8859]  152.98 98.92 0 top
NOREF#371  -  [Pad_e8898]  150.44 93.84 0 top
NOREF#372  -  [Pad_e9051]  132.66 73.52 0 top
NOREF#373  -  [Pad_e8939]  152.98 88.76 0 top
NOREF#374  -  [Pad_e9081]  158.06 70.98 0 top
NOREF#375  -  [Pad_e9040]  155.52 76.06 0 top
NOREF#376  -  [Pad_e8822]  160.6 104 0 top
NOREF#377  -  [Pad_e9153]  137.74 60.82 0 top
NOREF#378  -  [Pad_e8953]  137.74 86.22 0 top
NOREF#379  -  [Pad_e9065]  168.22 73.52 0 top
NOREF#380  -  [Pad_e8988]  125.04 81.14 0 top
NOREF#381  -  [Pad_e8917]  147.9 91.3 0 top
NOREF#382  -  [Pad_e8860]  155.52 98.92 0 top
NOREF#383  -  [Pad_e8873]  137.74 96.38 0 top
NOREF#384  -  [Pad_e8857]  147.9 98.92 0 top
NOREF#385  -  [Pad_e8872]  135.2 96.38 0 top
NOREF#386  -  [Pad_e9078]  150.44 70.98 0 top
NOREF#387  -  [Pad_e9082]  160.6 70.98 0 top
NOREF#388  -  [Pad_e9043]  163.14 76.06 0 top
NOREF#389  -  [Pad_e8938]  150.44 88.76 0 top
NOREF#390  -  [Pad_e8844]  165.68 101.46 0 top
NOREF#391  -  [Pad_e8916]  145.36 91.3 0 top
NOREF#392  -  [Pad_e8975]  142.82 83.68 0 top
NOREF#393  -  [Pad_e8818]  150.44 104 0 top
NOREF#394  -  [Pad_e9138]  150.44 63.36 0 top
NOREF#395  -  [Pad_e9046]  170.76 76.06 0 top
NOREF#396  -  [Pad_e8977]  147.9 83.68 0 top
NOREF#397  -  [Pad_e9126]  170.76 65.9 0 top
NOREF#398  -  [Pad_e8976]  145.36 83.68 0 top
NOREF#399  -  [Pad_e8881]  158.06 96.38 0 top
NOREF#400  -  [Pad_e8965]  168.22 86.22 0 top
NOREF#401  -  [Pad_e8850]  130.12 98.92 0 top
NOREF#402  -  [Pad_e8839]  152.98 101.46 0 top
NOREF#403  -  [Pad_e9119]  152.98 65.9 0 top
NOREF#404  -  [Pad_e9194]  140.28 55.74 0 top
NOREF#405  -  [Pad_e9002]  160.6 81.14 0 top
NOREF#406  -  [Pad_e8969]  127.58 83.68 0 top
NOREF#407  -  [Pad_e9019]  152.98 78.6 0 top
NOREF#408  -  [Pad_e9184]  165.68 58.28 0 top
NOREF#409  -  [Pad_e9034]  140.28 76.06 0 top
NOREF#410  -  [Pad_e8964]  165.68 86.22 0 top
NOREF#411  -  [Pad_e8851]  132.66 98.92 0 top
P1  2.54-1*6P母  [HDR-TH_6P-P2.54-V-F]  247.8 139 90 top
Q2  IRF4905STRLPBF  [D2PAK_L9.1-W10.0-P2.54-LS15.3-TL]  7.46 115.58 90 top
Q3  SI7469DP-T1-GE3  [POWERPAK-SO-8_L5.9-W4.9-P1.27-BL-EP]  57 96.5 180 top
QWIIC1  SM04B-SRSS-TB(LF)(SN)  [CONN-SMD_4P-P1.00_SM04B-SRSS-TB-LF-SN]  94.05 4.51 0 top
QWIIC2  SM04B-SRSS-TB(LF)(SN)  [CONN-SMD_4P-P1.00_SM04B-SRSS-TB-LF-SN]  101.8 4.51 0 top
QWIIC3  SM04B-SRSS-TB(LF)(SN)  [CONN-SMD_4P-P1.00_SM04B-SRSS-TB-LF-SN]  112.68 4.51 0 top
QWIIC4  SM04B-SRSS-TB(LF)(SN)  [CONN-SMD_4P-P1.00_SM04B-SRSS-TB-LF-SN]  120.43 4.51 0 top
QWIIC5  SM04B-SRSS-TB(LF)(SN)  [CONN-SMD_4P-P1.00_SM04B-SRSS-TB-LF-SN]  62.7 11.53 90 top
QWIIC6  SM04B-SRSS-TB(LF)(SN)  [CONN-SMD_4P-P1.00_SM04B-SRSS-TB-LF-SN]  62.7 19.2 90 top
R1  100kΩ  [R0603]  123.42 131.27 180 top
R3  33.2K  [R0402]  27.31 116.6 180 top
R4  100kΩ  [R0603]  22.75 116.68 0 top
R5  24kΩ  [R0603]  22.8 115.1 180 top
R6  1kΩ  [R0603]  21.4 112.6 90 top
R12  33.2K  [R0402]  62.9 120.2 180 top
R13  1kΩ  [R0603]  57.1 124.29 90 top
R14  100kΩ  [R0603]  123.42 132.79 180 top
R15  100kΩ  [R0603]  123.42 134.31 180 top
R16  10kΩ  [R0402]  123.24 143.13 180 top
R17  100kΩ  [R0603]  123.43 127.95 0 top
R18  100kΩ  [R0603]  123.44 126.37 0 top
R19  100kΩ  [R0603]  123.42 124.83 0 top
R20  100kΩ  [R0603]  140 131.27 180 top
R21  100kΩ  [R0603]  140 132.79 180 top
R22  10kΩ  [R0805]  6 101 180 top
R23  100kΩ  [R0603]  10 101 0 top
R24  10kΩ  [R0805]  109.83 52.16 180 top
R25  50kΩ  [R0805]  109.83 54.37 180 top
R26  82kΩ  [R0603]  59.9 120.1 0 top
R27  10kΩ  [R0805]  64.2 132.1 0 top
R28  10kΩ  [R0805]  109.83 58.77 180 top
R29  100kΩ  [R0603]  140 134.31 180 top
R30  10kΩ  [R0805]  109.83 62.67 180 top
R31  10kΩ  [R0402]  139.81 143.13 180 top
R32  10kΩ  [R0805]  109.83 56.57 0 top
R33  20kΩ  [R0603]  109.45 60.72 0 top
R34  100kΩ  [R0603]  52.5 94.5 180 top
R37  100kΩ  [R0603]  140.01 127.95 0 top
R40  100kΩ  [R0603]  156.55 132.79 180 top
R41  100kΩ  [R0603]  173.11 132.79 180 top
R42  100kΩ  [R0603]  156.55 131.27 180 top
R43  100kΩ  [R0603]  173.11 131.27 180 top
R44  100kΩ  [R0603]  156.55 134.31 180 top
R45  100kΩ  [R0603]  173.11 134.31 180 top
R46  10kΩ  [R0402]  156.37 143.13 180 top
R47  10kΩ  [R0402]  172.93 143.13 180 top
R48  100kΩ  [R0603]  156.56 127.95 0 top
R49  100kΩ  [R0603]  173.12 127.95 0 top
R50  100kΩ  [R0603]  156.57 126.37 0 top
R51  100kΩ  [R0603]  173.13 126.37 0 top
R52  100kΩ  [R0603]  156.56 124.83 0 top
R53  100kΩ  [R0603]  173.12 124.83 0 top
R57  10kΩ  [R0805]  100.38 11.94 180 top
R59  4.7kΩ  [R0603]  127.9 7.04 0 top
R60  4.7kΩ  [R0603]  127.89 8.66 0 top
R63  100kΩ  [R0603]  140.01 126.37 0 top
R64  100kΩ  [R0603]  140 124.83 0 top
R65  100Ω  [R0402]  27.81 123.4 180 top
R66  100Ω  [R0402]  63.4 127 180 top
R73  10kΩ  [R0805]  76.9 65.2 90 top
R83  1kΩ  [R0603]  43.19 108.4 180 top
R84  1kΩ  [R0603]  79.62 112.15 180 top
R85  1kΩ  [R0603]  95.56 136 0 top
R86  1kΩ  [R0603]  81.51 136.17 180 top
R87  1kΩ  [R0402]  124.86 144.24 180 top
R88  1kΩ  [R0402]  141.45 144.27 180 top
R90  1kΩ  [R0402]  174.63 144.16 180 top
R91  1kΩ  [R0402]  158.2 144.2 180 top
R92  1kΩ  [R0402]  132.3 29.6 0 top
R94  1kΩ  [R0402]  132.3 32.1 0 top
R95  1kΩ  [R0402]  132.3 37.1 0 top
R96  1kΩ  [R0402]  132.3 34.6 0 top
R97  1kΩ  [R0402]  132.3 27.1 0 top
R98  1kΩ  [R0402]  80.6 62.7 0 top
R99  1kΩ  [R0402]  80.6 67.9 0 top
R100  1kΩ  [R0402]  105.6 62.3 180 top
R101  1kΩ  [R0402]  89.2 62.3 180 top
RGB_LED  WS2812B-2020  [LED-SMD_4P-L2.0-W2.0-TL_WS2812B-2020]  170.16 27.25 90 top
SCREW1  -  [Screw-Hole-M2]  181 68 0 top
SCREW2  -  [Screw-Hole-M2]  246 68 0 top
SCREW3  -  [Screw-Hole-M2]  246 118 0 top
SCREW4  -  [Screw-Hole-M2]  181 118 0 top
SCREW5  -  [Screw-Hole-M2]  181 8 0 top
SCREW6  -  [Screw-Hole-M2]  246 8 0 top
SCREW7  -  [Screw-Hole-M2]  246 58 0 top
SCREW8  -  [Screw-Hole-M2]  181 58 0 top
servo_v+  HX PH254-01-02-Z-L11.5 male header connector  [HDR-TH_2P-P2.54-V-M]  239.6 123 180 top
SERVO_V_OUT  -  [2mm_exposure]  83.99 114.29 0 top
SHORT_MEGA_RX  -  [debug_shortcut]  75.6 74.2 315 top
SHORT_MEGA_TX  -  [debug_shortcut]  70.8 73.4 315 top
SHORT_SCL  -  [debug_shortcut]  113.4 13.7 180 top
SHORT_SDA  -  [debug_shortcut]  112.12 11.59 180 top
STP1  B4B-XH-A(LF)(SN)  [CONN-TH_B4B-XH-A-LF-SN]  125.45 147.74 0 top
STP2  B4B-XH-A(LF)(SN)  [CONN-TH_B4B-XH-A-LF-SN]  142.12 147.74 0 top
STP3  B4B-XH-A(LF)(SN)  [CONN-TH_B4B-XH-A-LF-SN]  158.67 147.74 0 top
STP4  B4B-XH-A(LF)(SN)  [CONN-TH_B4B-XH-A-LF-SN]  175.23 147.74 0 top
TX60  XT60  [CONN-TH_XT60PW-M]  19 136 270 top
U1  PM2.54-1X8PM-H85  [HDR-TH_8P-P2.54-V-F]  120.5 134.4 270 top
U2  PM2.54-1X8PM-H85  [HDR-TH_8P-P2.54-V-F]  133.2 134.4 90 top
U4  LTC4412ES6#TRPBF  [TSOT-23-6_L2.9-W1.6-P0.95-LS2.8-BR]  52.6 99.4 90 top
U5  -  [OSTTE120104]  76.25 145.52 180 top
U6  -  [OSTTE120104]  32.52 145.52 180 top
U7  AMS1117-3.3  [SOT-223-3_L6.5-W3.4-P2.30-LS7.0-BR]  67.4 138.2 0 top
U13  -  [Mega2560 Carrier]  116 8 90 top
U14  PM2.54-1X8PM-H85  [HDR-TH_8P-P2.54-V-F]  153.63 134.4 270 top
U15  PM2.54-1X8PM-H85  [HDR-TH_8P-P2.54-V-F]  170.19 134.4 270 top
U16  PM2.54-1X8PM-H85  [HDR-TH_8P-P2.54-V-F]  166.33 134.4 90 top
U17  PM2.54-1X8PM-H85  [HDR-TH_8P-P2.54-V-F]  182.89 134.4 90 top
U26  -  [short connect]  162.2 133.35 90 top
U27  -  [short connect]  178.76 133.35 90 top
U31  TXS0102DQER  [X2SON-8_L1.4-W1.0-P0.35-BL]  98 10 0 top
U34  -  [short connect]  129.07 133.35 90 top
U35  PM2.54-1X8PM-H85  [HDR-TH_8P-P2.54-V-F]  137.08 134.4 270 top
U36  PM2.54-1X8PM-H85  [HDR-TH_8P-P2.54-V-F]  149.78 134.4 90 top
U41  -  [short connect]  145.65 133.35 90 top
U42  2541WV-2x20P  [HDR-TH_40P-P2.54-V-M-R2-C20-S2.54]  59 56 270 top
U43  -  [OSTTE120104]  70 96 180 top
U44  -  [OSTTE120104]  108.5 29 0 top
U46  -  [OSTTE120104]  108.4 81.5 0 top
U47  -  [OSTTE120104]  70 43.5 180 top
U53  TXB0102DCUR  [VSSOP-8_L2.4-W2.1-P0.50-LS3.2-BR]  74.5 66.9 90 top
VR1  10kΩ  [RES-ADJ-TH_3362P]  58.4 128.4 180 top

## Footprints (pads in the part's own frame, mm; a bottom-side part is the same pattern mirrored in y, then rotated)
2mm_exposure
  round 2 smd: 1(0,0)
C0402
  rect 0.79x0.54 smd: 1(-0.545,0) 2(0.545,0)
C0805
  rect 1.41x1.35 smd: 1(-1,0) 2(1,0)
C1206
  rect 1.485x1.728 smd: 1(-1.593,0) 2(1.593,0)
CAP-SMD_BD4.0-L4.3-W4.3-FD-LS5.5
  rect 2.8x1.1 smd: 1(-1.661,0) 2(1.661,0)
CAP-SMD_BD6.3-L6.6-W6.6-FD
  rect 3.5x1.2 smd: 1(-2.67,0) 2(2.67,0)
CAP-SMD_BD6.3-L6.6-W6.6-LS7.2-FD
  rect 3.5x1.2 smd: 1(-2.67,0) 2(2.67,0)
CONN-SMD_4P-P1.00_SM04B-SRSS-TB-LF-SN
  rect 0.6x1.55 smd: 1(-1.5,1.938) 2(-0.5,1.938) 3(0.5,1.938) 4(1.5,1.938)
  rect 1.2x1.8 smd: 5(2.8,-1.938) 6(-2.8,-1.938)
CONN-TH_3P-P2.50_A2501WV2-3P
  round 1.55 hole 0.9: 1(-2.5,0) 2(0,0) 3(2.5,0)
CONN-TH_705430003
  round 1.7 hole 1: 1(3.81,0) 2(1.27,0) 3(-1.27,0) 4(-3.81,0)
CONN-TH_B4B-XH-A-LF-SN
  round 1.7 hole 1: 1(3.75,0) 2(1.25,0) 3(-1.25,0) 4(-3.75,0)
CONN-TH_XT60PW-M
  round 3.8 hole 2.9: 1(3,-3.6) 2(3,3.6)
  oval 2.2x1.2 hole 1.6x0.6: 3(-3,6.75) 4(-3,-6.75)
D2PAK_L9.1-W10.0-P2.54-LS15.3-TL
  rect 3.358x1.134 smd: 1(-5.286,2.54) 3(-5.286,-2.54)
  rect 7.181x10.566 smd: 4(5.286,0)
debug_shortcut
  round 2 smd: 1(-3,0) 2(3,0)
  rect 1.2x1.5 smd: 1(-0.8,0) 2(0.8,0)
FUSE-TH_4P-L19.8-W6.7_3557-2
  round 2.5 hole 1.8: 1(-6.735,1.7) 2(-6.735,-1.7) 3(6.735,1.7) 4(6.735,-1.7)
HDR-TH_2P-P2.54-V-M
  rect 2x2 hole 1.2: 1(-1.27,0)
  round 2 hole 1.2: 2(1.27,0)
HDR-TH_2P-P2.54-V-M-3
  rect 1.8x1.8 hole 1.1: 1(-1.27,0)
  round 1.8 hole 1.1: 2(1.27,0)
HDR-TH_6P-P2.54-V-F
  rect 1.8x1.8 hole 1.02: 1(-6.35,0)
  round 1.6 hole 1.02: 2(-3.81,0) 3(-1.27,0) 4(1.27,0) 5(3.81,0) 6(6.35,0)
HDR-TH_8P-P2.54-V-F
  rect 1.575x1.7 hole 1.1: 1(-8.89,0)
  round 1.7 hole 1.1: 2(-6.35,0) 3(-3.81,0) 4(-1.27,0) 5(1.27,0) 6(3.81,0) 7(6.35,0) 8(8.89,0)
HDR-TH_12P-P2.54-V-F-R2-C6-S2.54
  rect 1.7x1.7 hole 1.1: 1(-6.35,-1.27)
  round 1.7 hole 1.1: 2(-6.35,1.27) 3(-3.81,-1.27) 4(-3.81,1.27) 5(-1.27,-1.27) 6(-1.27,1.27) 7(1.27,-1.27) 8(1.27,1.27) 9(3.81,-1.27) 10(3.81,1.27) 11(6.35,-1.27) 12(6.35,1.27)
HDR-TH_40P-P2.54-V-F-R2-C20-S2.54
  rect 1.6x1.6 hole 1: 1(-24.13,-1.27)
  round 1.6 hole 1: 2(-24.13,1.27) 3(-21.59,-1.27) 4(-21.59,1.27) 5(-19.05,-1.27) 6(-19.05,1.27) 7(-16.51,-1.27) 8(-16.51,1.27) 9(-13.97,-1.27) 10(-13.97,1.27) 11(-11.43,-1.27) 12(-11.43,1.27) 13(-8.89,-1.27) 14(-8.89,1.27) 15(-6.35,-1.27) 16(-6.35,1.27) 17(-3.81,-1.27) 18(-3.81,1.27) 19(-1.27,-1.27) 20(-1.27,1.27) 21(1.27,-1.27) 22(1.27,1.27) 23(3.81,-1.27) 24(3.81,1.27) 25(6.35,-1.27) 26(6.35,1.27) 27(8.89,-1.27) 28(8.89,1.27) 29(11.43,-1.27) 30(11.43,1.27) 31(13.97,-1.27) 32(13.97,1.27) 33(16.51,-1.27) 34(16.51,1.27) 35(19.05,-1.27) 36(19.05,1.27) 37(21.59,-1.27) 38(21.59,1.27) 39(24.13,-1.27) 40(24.13,1.27)
HDR-TH_40P-P2.54-V-M-R2-C20-S2.54
  rect 1.575x1.8 hole 1.1: 1(-24.13,-1.27)
  round 1.8 hole 1.1: 2(-24.13,1.27) 3(-21.59,-1.27) 4(-21.59,1.27) 5(-19.05,-1.27) 6(-19.05,1.27) 7(-16.51,-1.27) 8(-16.51,1.27) 9(-13.97,-1.27) 10(-13.97,1.27) 11(-11.43,-1.27) 12(-11.43,1.27) 13(-8.89,-1.27) 14(-8.89,1.27) 15(-6.35,-1.27) 16(-6.35,1.27) 17(-3.81,-1.27) 18(-3.81,1.27) 19(-1.27,-1.27) 20(-1.27,1.27) 21(1.27,-1.27) 22(1.27,1.27) 23(3.81,-1.27) 24(3.81,1.27) 25(6.35,-1.27) 26(6.35,1.27) 27(8.89,-1.27) 28(8.89,1.27) 29(11.43,-1.27) 30(11.43,1.27) 31(13.97,-1.27) 32(13.97,1.27) 33(16.51,-1.27) 34(16.51,1.27) 35(19.05,-1.27) 36(19.05,1.27) 37(21.59,-1.27) 38(21.59,1.27) 39(24.13,-1.27) 40(24.13,1.27)
IND-SMD_L11.0-W10.0
  rect 3.5x3.5 smd: 1(-4.95,0) 2(4.95,0)
LED0603-RD
  rect 0.8x0.8 smd: 1(-0.799,0) 2(0.799,0)
LED0603-RD_BLUE
  rect 0.8x0.8 smd: 1(-0.799,-0.004) 2(0.799,0.004)
LED0603-RD_PINK
  rect 0.8x0.8 smd: 1(-0.799,-0.004) 2(0.799,0.004)
LED0603-RD_RED
  rect 0.8x0.8 smd: 1(-0.799,-0.004) 2(0.799,0.004)
LED-SMD_4P-L2.0-W2.0-TL_WS2812B-2020
  rect 0.9x0.7 smd: 1(-0.915,0.55) 2(-0.915,-0.55) 3(0.915,-0.55) 4(0.915,0.55)
Mega2560 Carrier
  round 3.5 hole 3.2: (66.04,35.535) (66.04,7.595) (90.17,50.775) (96.52,2.514)
  round 1.5 hole 0.85: 1(94.07,50.775) 2(94.07,48.234) 3(94.07,45.694) 4(94.07,43.154) 5(94.07,40.614) 6(94.07,38.075) 7(94.07,35.535) 8(94.07,32.995) 9(94.07,30.454) 10(94.07,27.915) 11(94.07,25.375) 12(94.07,22.834) 13(94.07,20.294) 14(94.07,17.755) 15(94.07,15.214) 16(94.07,12.675) 17(94.07,10.134) 18(94.07,7.595) 19(96.52,7.595) 20(96.52,10.134) 21(96.52,12.675) 22(96.52,15.214) 23(96.52,17.755) 24(96.52,20.294) 25(96.52,22.834) 26(96.52,25.375) 27(96.52,27.915) 28(96.52,30.454) 29(96.52,32.995) 30(96.52,35.535) 31(96.52,38.075) 32(96.52,40.614) 33(96.52,43.154) 34(96.52,45.694) 35(96.52,48.234) 36(96.52,50.775) 37(27.94,2.514) 38(30.48,2.514) 39(33.02,2.514) 40(35.56,2.514) 41(38.1,2.514) 42(40.64,2.514) 43(43.18,2.514) 44(45.72,2.514) 46(50.8,2.514) 47(53.34,2.514) 48(55.88,2.514) 49(58.42,2.514) 50(60.96,2.514) 51(63.5,2.514) 52(66.04,2.514) 53(68.58,2.514) 55(73.66,2.514) 56(76.2,2.514) 57(78.74,2.514) 58(81.28,2.514) 59(83.82,2.514) 60(86.36,2.514) 61(88.9,2.514) 62(91.44,2.514) 63(18.796,50.775) 64(21.336,50.775) 65(23.876,50.775) 66(26.416,50.775) 67(28.956,50.775) 68(31.496,50.775) 69(34.036,50.775) 70(36.576,50.775) 71(39.116,50.775) 72(41.656,50.775) 73(45.72,50.775) 74(48.26,50.775) 75(50.8,50.775) 76(53.34,50.775) 77(55.88,50.775) 78(58.42,50.775) 79(60.96,50.775) 80(63.5,50.775) 82(68.58,50.775) 83(71.12,50.775) 84(73.66,50.775) 85(76.2,50.775) 86(78.74,50.775) 87(81.28,50.775) 88(83.82,50.775) 89(86.36,50.775)
OSTTE120104
  oval 2x3 hole 1.1: 1(0,0) 2(-3.5,0) 3(-7,0) 4(-10.5,0) 5(-14,0) 6(-17.5,0) 7(-21,0) 8(-24.5,0) 9(-28,0) 10(-31.5,0) 11(-35,0) 12(-38.5,0)
Pad_e159
  round 1.7 hole 1: 1(0,0)
Pad_e483
  round 3 hole 3: 1(0,0)
Pad_e485
  round 3 hole 3: 1(0,0)
Pad_e486
  round 3 hole 3: 1(0,0)
Pad_e487
  round 3 hole 3: 1(0,0)
Pad_e6985
  round 4 hole 3: 1(0,0)
Pad_e7452
  round 4 hole 3: 1(0,0)
Pad_e7453
  round 4 hole 3: 1(0,0)
Pad_e8808
  round 1.7 hole 1: 2(0,0)
Pad_e8809
  round 1.7 hole 1: 45(0,0)
Pad_e8810
  round 1.7 hole 1: 54(0,0)
Pad_e8811
  round 1.7 hole 1: 81(0,0)
Pad_e8812
  round 1.7 hole 1: 90(0,0)
Pad_e8813
  round 1.7 hole 1: 91(0,0)
Pad_e8814
  round 1.7 hole 1: 92(0,0)
Pad_e8815
  round 1.7 hole 1: 93(0,0)
Pad_e8816
  round 1.7 hole 1: 94(0,0)
Pad_e8817
  round 1.7 hole 1: 95(0,0)
Pad_e8818
  round 1.7 hole 1: 96(0,0)
Pad_e8819
  round 1.7 hole 1: 97(0,0)
Pad_e8820
  round 1.7 hole 1: 98(0,0)
Pad_e8821
  round 1.7 hole 1: 99(0,0)
Pad_e8822
  round 1.7 hole 1: 100(0,0)
Pad_e8823
  round 1.7 hole 1: 101(0,0)
Pad_e8824
  round 1.7 hole 1: 102(0,0)
Pad_e8825
  round 1.7 hole 1: 103(0,0)
Pad_e8826
  round 1.7 hole 1: 104(0,0)
Pad_e8827
  round 1.7 hole 1: 105(0,0)
Pad_e8828
  round 1.7 hole 1: 106(0,0)
Pad_e8829
  round 1.7 hole 1: 107(0,0)
Pad_e8830
  round 1.7 hole 1: 108(0,0)
Pad_e8831
  round 1.7 hole 1: 109(0,0)
Pad_e8832
  round 1.7 hole 1: 110(0,0)
Pad_e8833
  round 1.7 hole 1: 111(0,0)
Pad_e8834
  round 1.7 hole 1: 112(0,0)
Pad_e8835
  round 1.7 hole 1: 113(0,0)
Pad_e8836
  round 1.7 hole 1: 114(0,0)
Pad_e8837
  round 1.7 hole 1: 115(0,0)
Pad_e8838
  round 1.7 hole 1: 116(0,0)
Pad_e8839
  round 1.7 hole 1: 117(0,0)
Pad_e8840
  round 1.7 hole 1: 118(0,0)
Pad_e8841
  round 1.7 hole 1: 119(0,0)
Pad_e8842
  round 1.7 hole 1: 120(0,0)
Pad_e8843
  round 1.7 hole 1: 121(0,0)
Pad_e8844
  round 1.7 hole 1: 122(0,0)
Pad_e8845
  round 1.7 hole 1: 123(0,0)
Pad_e8846
  round 1.7 hole 1: 124(0,0)
Pad_e8847
  round 1.7 hole 1: 125(0,0)
Pad_e8848
  round 1.7 hole 1: 126(0,0)
Pad_e8849
  round 1.7 hole 1: 127(0,0)
Pad_e8850
  round 1.7 hole 1: 128(0,0)
Pad_e8851
  round 1.7 hole 1: 129(0,0)
Pad_e8852
  round 1.7 hole 1: 130(0,0)
Pad_e8853
  round 1.7 hole 1: 131(0,0)
Pad_e8854
  round 1.7 hole 1: 132(0,0)
Pad_e8855
  round 1.7 hole 1: 133(0,0)
Pad_e8856
  round 1.7 hole 1: 134(0,0)
Pad_e8857
  round 1.7 hole 1: 135(0,0)
Pad_e8858
  round 1.7 hole 1: 136(0,0)
Pad_e8859
  round 1.7 hole 1: 137(0,0)
Pad_e8860
  round 1.7 hole 1: 138(0,0)
Pad_e8861
  round 1.7 hole 1: 139(0,0)
Pad_e8862
  round 1.7 hole 1: 140(0,0)
Pad_e8863
  round 1.7 hole 1: 141(0,0)
Pad_e8864
  round 1.7 hole 1: 142(0,0)
Pad_e8865
  round 1.7 hole 1: 143(0,0)
Pad_e8866
  round 1.7 hole 1: 144(0,0)
Pad_e8867
  round 1.7 hole 1: 145(0,0)
Pad_e8868
  round 1.7 hole 1: 146(0,0)
Pad_e8869
  round 1.7 hole 1: 147(0,0)
Pad_e8870
  round 1.7 hole 1: 148(0,0)
Pad_e8871
  round 1.7 hole 1: 149(0,0)
Pad_e8872
  round 1.7 hole 1: 150(0,0)
Pad_e8873
  round 1.7 hole 1: 151(0,0)
Pad_e8874
  round 1.7 hole 1: 152(0,0)
Pad_e8875
  round 1.7 hole 1: 153(0,0)
Pad_e8876
  round 1.7 hole 1: 154(0,0)
Pad_e8877
  round 1.7 hole 1: 155(0,0)
Pad_e8878
  round 1.7 hole 1: 156(0,0)
Pad_e8879
  round 1.7 hole 1: 157(0,0)
Pad_e8880
  round 1.7 hole 1: 158(0,0)
Pad_e8881
  round 1.7 hole 1: 159(0,0)
Pad_e8882
  round 1.7 hole 1: 160(0,0)
Pad_e8883
  round 1.7 hole 1: 161(0,0)
Pad_e8884
  round 1.7 hole 1: 162(0,0)
Pad_e8885
  round 1.7 hole 1: 163(0,0)
Pad_e8886
  round 1.7 hole 1: 164(0,0)
Pad_e8887
  round 1.7 hole 1: 165(0,0)
Pad_e8888
  round 1.7 hole 1: 166(0,0)
Pad_e8889
  round 1.7 hole 1: 167(0,0)
Pad_e8890
  round 1.7 hole 1: 168(0,0)
Pad_e8891
  round 1.7 hole 1: 169(0,0)
Pad_e8892
  round 1.7 hole 1: 170(0,0)
Pad_e8893
  round 1.7 hole 1: 171(0,0)
Pad_e8894
  round 1.7 hole 1: 172(0,0)
Pad_e8895
  round 1.7 hole 1: 173(0,0)
Pad_e8896
  round 1.7 hole 1: 174(0,0)
Pad_e8897
  round 1.7 hole 1: 175(0,0)
Pad_e8898
  round 1.7 hole 1: 176(0,0)
Pad_e8899
  round 1.7 hole 1: 177(0,0)
Pad_e8900
  round 1.7 hole 1: 178(0,0)
Pad_e8901
  round 1.7 hole 1: 179(0,0)
Pad_e8902
  round 1.7 hole 1: 180(0,0)
Pad_e8903
  round 1.7 hole 1: 181(0,0)
Pad_e8904
  round 1.7 hole 1: 182(0,0)
Pad_e8905
  round 1.7 hole 1: 183(0,0)
Pad_e8906
  round 1.7 hole 1: 184(0,0)
Pad_e8907
  round 1.7 hole 1: 185(0,0)
Pad_e8908
  round 1.7 hole 1: 186(0,0)
Pad_e8909
  round 1.7 hole 1: 187(0,0)
Pad_e8910
  round 1.7 hole 1: 188(0,0)
Pad_e8911
  round 1.7 hole 1: 189(0,0)
Pad_e8912
  round 1.7 hole 1: 190(0,0)
Pad_e8913
  round 1.7 hole 1: 191(0,0)
Pad_e8914
  round 1.7 hole 1: 192(0,0)
Pad_e8915
  round 1.7 hole 1: 193(0,0)
Pad_e8916
  round 1.7 hole 1: 194(0,0)
Pad_e8917
  round 1.7 hole 1: 195(0,0)
Pad_e8918
  round 1.7 hole 1: 196(0,0)
Pad_e8919
  round 1.7 hole 1: 197(0,0)
Pad_e8920
  round 1.7 hole 1: 198(0,0)
Pad_e8921
  round 1.7 hole 1: 199(0,0)
Pad_e8922
  round 1.7 hole 1: 200(0,0)
Pad_e8923
  round 1.7 hole 1: 201(0,0)
Pad_e8924
  round 1.7 hole 1: 202(0,0)
Pad_e8925
  round 1.7 hole 1: 203(0,0)
Pad_e8926
  round 1.7 hole 1: 204(0,0)
Pad_e8927
  round 1.7 hole 1: 205(0,0)
Pad_e8928
  round 1.7 hole 1: 206(0,0)
Pad_e8929
  round 1.7 hole 1: 207(0,0)
Pad_e8930
  round 1.7 hole 1: 208(0,0)
Pad_e8931
  round 1.7 hole 1: 209(0,0)
Pad_e8932
  round 1.7 hole 1: 210(0,0)
Pad_e8933
  round 1.7 hole 1: 211(0,0)
Pad_e8934
  round 1.7 hole 1: 212(0,0)
Pad_e8935
  round 1.7 hole 1: 213(0,0)
Pad_e8936
  round 1.7 hole 1: 214(0,0)
Pad_e8937
  round 1.7 hole 1: 215(0,0)
Pad_e8938
  round 1.7 hole 1: 216(0,0)
Pad_e8939
  round 1.7 hole 1: 217(0,0)
Pad_e8940
  round 1.7 hole 1: 218(0,0)
Pad_e8941
  round 1.7 hole 1: 219(0,0)
Pad_e8942
  round 1.7 hole 1: 220(0,0)
Pad_e8943
  round 1.7 hole 1: 221(0,0)
Pad_e8944
  round 1.7 hole 1: 222(0,0)
Pad_e8945
  round 1.7 hole 1: 223(0,0)
Pad_e8946
  round 1.7 hole 1: 224(0,0)
Pad_e8947
  round 1.7 hole 1: 225(0,0)
Pad_e8948
  round 1.7 hole 1: 226(0,0)
Pad_e8949
  round 1.7 hole 1: 227(0,0)
Pad_e8950
  round 1.7 hole 1: 228(0,0)
Pad_e8951
  round 1.7 hole 1: 229(0,0)
Pad_e8952
  round 1.7 hole 1: 230(0,0)
Pad_e8953
  round 1.7 hole 1: 231(0,0)
Pad_e8954
  round 1.7 hole 1: 232(0,0)
Pad_e8955
  round 1.7 hole 1: 233(0,0)
Pad_e8956
  round 1.7 hole 1: 234(0,0)
Pad_e8957
  round 1.7 hole 1: 235(0,0)
Pad_e8958
  round 1.7 hole 1: 236(0,0)
Pad_e8959
  round 1.7 hole 1: 237(0,0)
Pad_e8960
  round 1.7 hole 1: 238(0,0)
Pad_e8961
  round 1.7 hole 1: 239(0,0)
Pad_e8962
  round 1.7 hole 1: 240(0,0)
Pad_e8963
  round 1.7 hole 1: 241(0,0)
Pad_e8964
  round 1.7 hole 1: 242(0,0)
Pad_e8965
  round 1.7 hole 1: 243(0,0)
Pad_e8966
  round 1.7 hole 1: 244(0,0)
Pad_e8967
  round 1.7 hole 1: 245(0,0)
Pad_e8968
  round 1.7 hole 1: 246(0,0)
Pad_e8969
  round 1.7 hole 1: 247(0,0)
Pad_e8970
  round 1.7 hole 1: 248(0,0)
Pad_e8971
  round 1.7 hole 1: 249(0,0)
Pad_e8972
  round 1.7 hole 1: 250(0,0)
Pad_e8973
  round 1.7 hole 1: 251(0,0)
Pad_e8974
  round 1.7 hole 1: 252(0,0)
Pad_e8975
  round 1.7 hole 1: 253(0,0)
Pad_e8976
  round 1.7 hole 1: 254(0,0)
Pad_e8977
  round 1.7 hole 1: 255(0,0)
Pad_e8978
  round 1.7 hole 1: 256(0,0)
Pad_e8979
  round 1.7 hole 1: 257(0,0)
Pad_e8980
  round 1.7 hole 1: 258(0,0)
Pad_e8981
  round 1.7 hole 1: 259(0,0)
Pad_e8982
  round 1.7 hole 1: 260(0,0)
Pad_e8983
  round 1.7 hole 1: 261(0,0)
Pad_e8984
  round 1.7 hole 1: 262(0,0)
Pad_e8985
  round 1.7 hole 1: 263(0,0)
Pad_e8986
  round 1.7 hole 1: 264(0,0)
Pad_e8987
  round 1.7 hole 1: 265(0,0)
Pad_e8988
  round 1.7 hole 1: 266(0,0)
Pad_e8989
  round 1.7 hole 1: 267(0,0)
Pad_e8990
  round 1.7 hole 1: 268(0,0)
Pad_e8991
  round 1.7 hole 1: 269(0,0)
Pad_e8992
  round 1.7 hole 1: 270(0,0)
Pad_e8993
  round 1.7 hole 1: 271(0,0)
Pad_e8994
  round 1.7 hole 1: 272(0,0)
Pad_e8995
  round 1.7 hole 1: 273(0,0)
Pad_e8996
  round 1.7 hole 1: 274(0,0)
Pad_e8997
  round 1.7 hole 1: 275(0,0)
Pad_e8998
  round 1.7 hole 1: 276(0,0)
Pad_e8999
  round 1.7 hole 1: 277(0,0)
Pad_e9000
  round 1.7 hole 1: 278(0,0)
Pad_e9001
  round 1.7 hole 1: 279(0,0)
Pad_e9002
  round 1.7 hole 1: 280(0,0)
Pad_e9003
  round 1.7 hole 1: 281(0,0)
Pad_e9004
  round 1.7 hole 1: 282(0,0)
Pad_e9005
  round 1.7 hole 1: 283(0,0)
Pad_e9006
  round 1.7 hole 1: 284(0,0)
Pad_e9007
  round 1.7 hole 1: 285(0,0)
Pad_e9008
  round 1.7 hole 1: 286(0,0)
Pad_e9009
  round 1.7 hole 1: 287(0,0)
Pad_e9010
  round 1.7 hole 1: 288(0,0)
Pad_e9011
  round 1.7 hole 1: 289(0,0)
Pad_e9012
  round 1.7 hole 1: 290(0,0)
Pad_e9013
  round 1.7 hole 1: 291(0,0)
Pad_e9014
  round 1.7 hole 1: 292(0,0)
Pad_e9015
  round 1.7 hole 1: 293(0,0)
Pad_e9016
  round 1.7 hole 1: 294(0,0)
Pad_e9017
  round 1.7 hole 1: 295(0,0)
Pad_e9018
  round 1.7 hole 1: 296(0,0)
Pad_e9019
  round 1.7 hole 1: 297(0,0)
Pad_e9020
  round 1.7 hole 1: 298(0,0)
Pad_e9021
  round 1.7 hole 1: 299(0,0)
Pad_e9022
  round 1.7 hole 1: 300(0,0)
Pad_e9023
  round 1.7 hole 1: 301(0,0)
Pad_e9024
  round 1.7 hole 1: 302(0,0)
Pad_e9025
  round 1.7 hole 1: 303(0,0)
Pad_e9026
  round 1.7 hole 1: 304(0,0)
Pad_e9027
  round 1.7 hole 1: 305(0,0)
Pad_e9028
  round 1.7 hole 1: 306(0,0)
Pad_e9029
  round 1.7 hole 1: 307(0,0)
Pad_e9030
  round 1.7 hole 1: 308(0,0)
Pad_e9031
  round 1.7 hole 1: 309(0,0)
Pad_e9032
  round 1.7 hole 1: 310(0,0)
Pad_e9033
  round 1.7 hole 1: 311(0,0)
Pad_e9034
  round 1.7 hole 1: 312(0,0)
Pad_e9035
  round 1.7 hole 1: 313(0,0)
Pad_e9036
  round 1.7 hole 1: 314(0,0)
Pad_e9037
  round 1.7 hole 1: 315(0,0)
Pad_e9038
  round 1.7 hole 1: 316(0,0)
Pad_e9039
  round 1.7 hole 1: 317(0,0)
Pad_e9040
  round 1.7 hole 1: 318(0,0)
Pad_e9041
  round 1.7 hole 1: 319(0,0)
Pad_e9042
  round 1.7 hole 1: 320(0,0)
Pad_e9043
  round 1.7 hole 1: 321(0,0)
Pad_e9044
  round 1.7 hole 1: 322(0,0)
Pad_e9045
  round 1.7 hole 1: 323(0,0)
Pad_e9046
  round 1.7 hole 1: 324(0,0)
Pad_e9047
  round 1.7 hole 1: 325(0,0)
Pad_e9048
  round 1.7 hole 1: 326(0,0)
Pad_e9049
  round 1.7 hole 1: 327(0,0)
Pad_e9050
  round 1.7 hole 1: 328(0,0)
Pad_e9051
  round 1.7 hole 1: 329(0,0)
Pad_e9052
  round 1.7 hole 1: 330(0,0)
Pad_e9053
  round 1.7 hole 1: 331(0,0)
Pad_e9054
  round 1.7 hole 1: 332(0,0)
Pad_e9055
  round 1.7 hole 1: 333(0,0)
Pad_e9056
  round 1.7 hole 1: 334(0,0)
Pad_e9057
  round 1.7 hole 1: 335(0,0)
Pad_e9058
  round 1.7 hole 1: 336(0,0)
Pad_e9059
  round 1.7 hole 1: 337(0,0)
Pad_e9060
  round 1.7 hole 1: 338(0,0)
Pad_e9061
  round 1.7 hole 1: 339(0,0)
Pad_e9062
  round 1.7 hole 1: 340(0,0)
Pad_e9063
  round 1.7 hole 1: 341(0,0)
Pad_e9064
  round 1.7 hole 1: 342(0,0)
Pad_e9065
  round 1.7 hole 1: 343(0,0)
Pad_e9066
  round 1.7 hole 1: 344(0,0)
Pad_e9067
  round 1.7 hole 1: 345(0,0)
Pad_e9068
  round 1.7 hole 1: 346(0,0)
Pad_e9069
  round 1.7 hole 1: 347(0,0)
Pad_e9070
  round 1.7 hole 1: 348(0,0)
Pad_e9071
  round 1.7 hole 1: 349(0,0)
Pad_e9072
  round 1.7 hole 1: 350(0,0)
Pad_e9073
  round 1.7 hole 1: 351(0,0)
Pad_e9074
  round 1.7 hole 1: 352(0,0)
Pad_e9075
  round 1.7 hole 1: 353(0,0)
Pad_e9076
  round 1.7 hole 1: 354(0,0)
Pad_e9077
  round 1.7 hole 1: 355(0,0)
Pad_e9078
  round 1.7 hole 1: 356(0,0)
Pad_e9079
  round 1.7 hole 1: 357(0,0)
Pad_e9080
  round 1.7 hole 1: 358(0,0)
Pad_e9081
  round 1.7 hole 1: 359(0,0)
Pad_e9082
  round 1.7 hole 1: 360(0,0)
Pad_e9083
  round 1.7 hole 1: 361(0,0)
Pad_e9084
  round 1.7 hole 1: 362(0,0)
Pad_e9085
  round 1.7 hole 1: 363(0,0)
Pad_e9086
  round 1.7 hole 1: 364(0,0)
Pad_e9087
  round 1.7 hole 1: 365(0,0)
Pad_e9088
  round 1.7 hole 1: 366(0,0)
Pad_e9089
  round 1.7 hole 1: 367(0,0)
Pad_e9090
  round 1.7 hole 1: 368(0,0)
Pad_e9091
  round 1.7 hole 1: 369(0,0)
Pad_e9092
  round 1.7 hole 1: 370(0,0)
Pad_e9093
  round 1.7 hole 1: 371(0,0)
Pad_e9094
  round 1.7 hole 1: 372(0,0)
Pad_e9095
  round 1.7 hole 1: 373(0,0)
Pad_e9096
  round 1.7 hole 1: 374(0,0)
Pad_e9097
  round 1.7 hole 1: 375(0,0)
Pad_e9098
  round 1.7 hole 1: 376(0,0)
Pad_e9099
  round 1.7 hole 1: 377(0,0)
Pad_e9100
  round 1.7 hole 1: 378(0,0)
Pad_e9101
  round 1.7 hole 1: 379(0,0)
Pad_e9102
  round 1.7 hole 1: 380(0,0)
Pad_e9103
  round 1.7 hole 1: 381(0,0)
Pad_e9104
  round 1.7 hole 1: 382(0,0)
